# EAGLE design Plug-In_Pet_Infinite_Thick (EAGLE 9.6.2)
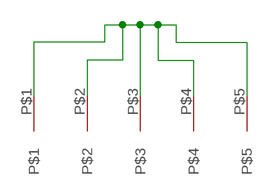
[diagram p0: schematic, sheet 1]

## Parts
U$1  PLUGINPET  [PLUGINPET]

## Nets
N$2: U$1.P$1 U$1.P$2 U$1.P$3 U$1.P$4 U$1.P$5

## Library data of the parts
U$1 = Plug-In Pet:PLUGINPET

## Board
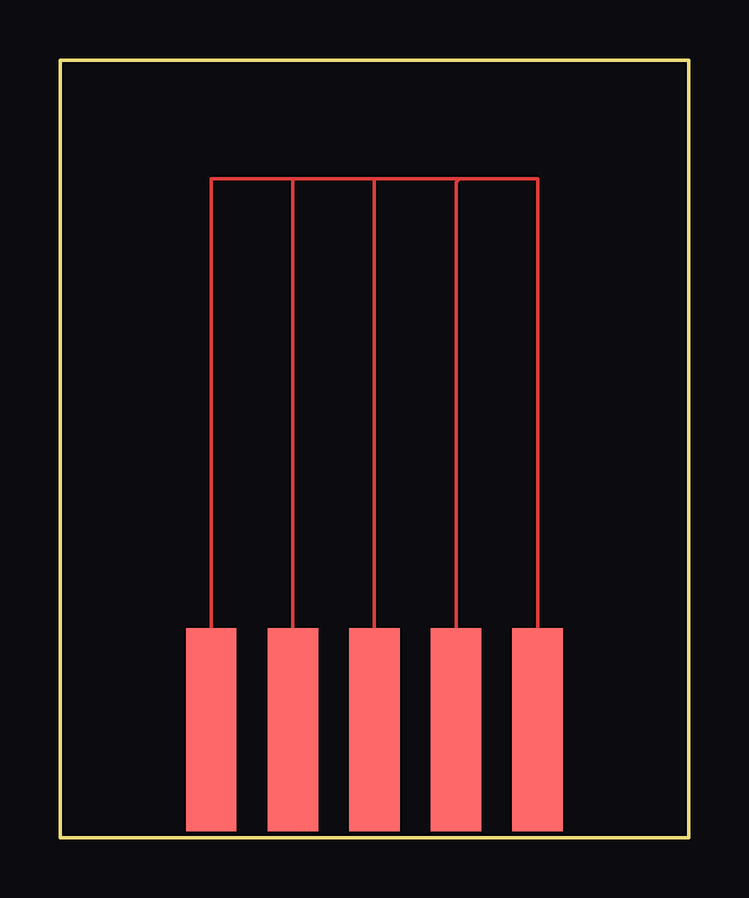
[diagram p1: board, top side]

Size 26.2 x 32.4 mm. Coordinates in mm from the lower left corner, seen from the top.
Outline: 26.2,0 0,0 0,32.4 26.2,32.4 26.2,0
Copper layers (1*16): Top 0.035mm / dielectric 1.5mm / Bottom 0.035mm
Design rules "default": minimum track width 6mil, minimum drill 0.35mm, track to track 6mil, track to pad 6mil, pad to pad 6mil, via to via 6mil, smd to smd 6mil, copper to edge 40mil, drill to drill 6mil, minimum pad ring 10mil, minimum via ring 8mil, stop-mask expansion 4mil, vias tented up to drill 0mil, thermal gap 10mil

### Footprints (pad centres in the part's own frame; a part is rotated, then mirrored left to right if it is on the bottom)
PLUGINPET = smd 2.1 x 8.45: P$1 0,0; P$2 3.4,0; P$3 6.8,0; P$4 10.2,0; P$5 13.6,0

### Placement (x,y rotation side)
U$1  6.3,4.5 0 top

### Tracks (layer width: path | path; a pad name or v marks a point on that pad's centre or on a via)
N$2
  Top 0.152: U$1.P$1 6.3,27.45 9.65,27.45 | 9.65,27.45 13.1,27.45 | 13.1,27.45 16.65,27.45 | 16.65,27.45 19.9,27.45 19.9,8.95 19.9,8.25 U$1.P$5 | U$1.P$2 9.7,27.4 9.65,27.45 | U$1.P$3 13.1,27.45 | U$1.P$4 16.5,27.3 16.65,27.45